# Altium schematic sheet TOP.SchDoc: ANT_Miner_V1.3
size A4; Date: 2013/11/20; DrawnBy: Bitmain technology; SheetNumber: 1; SheetTotal: 9
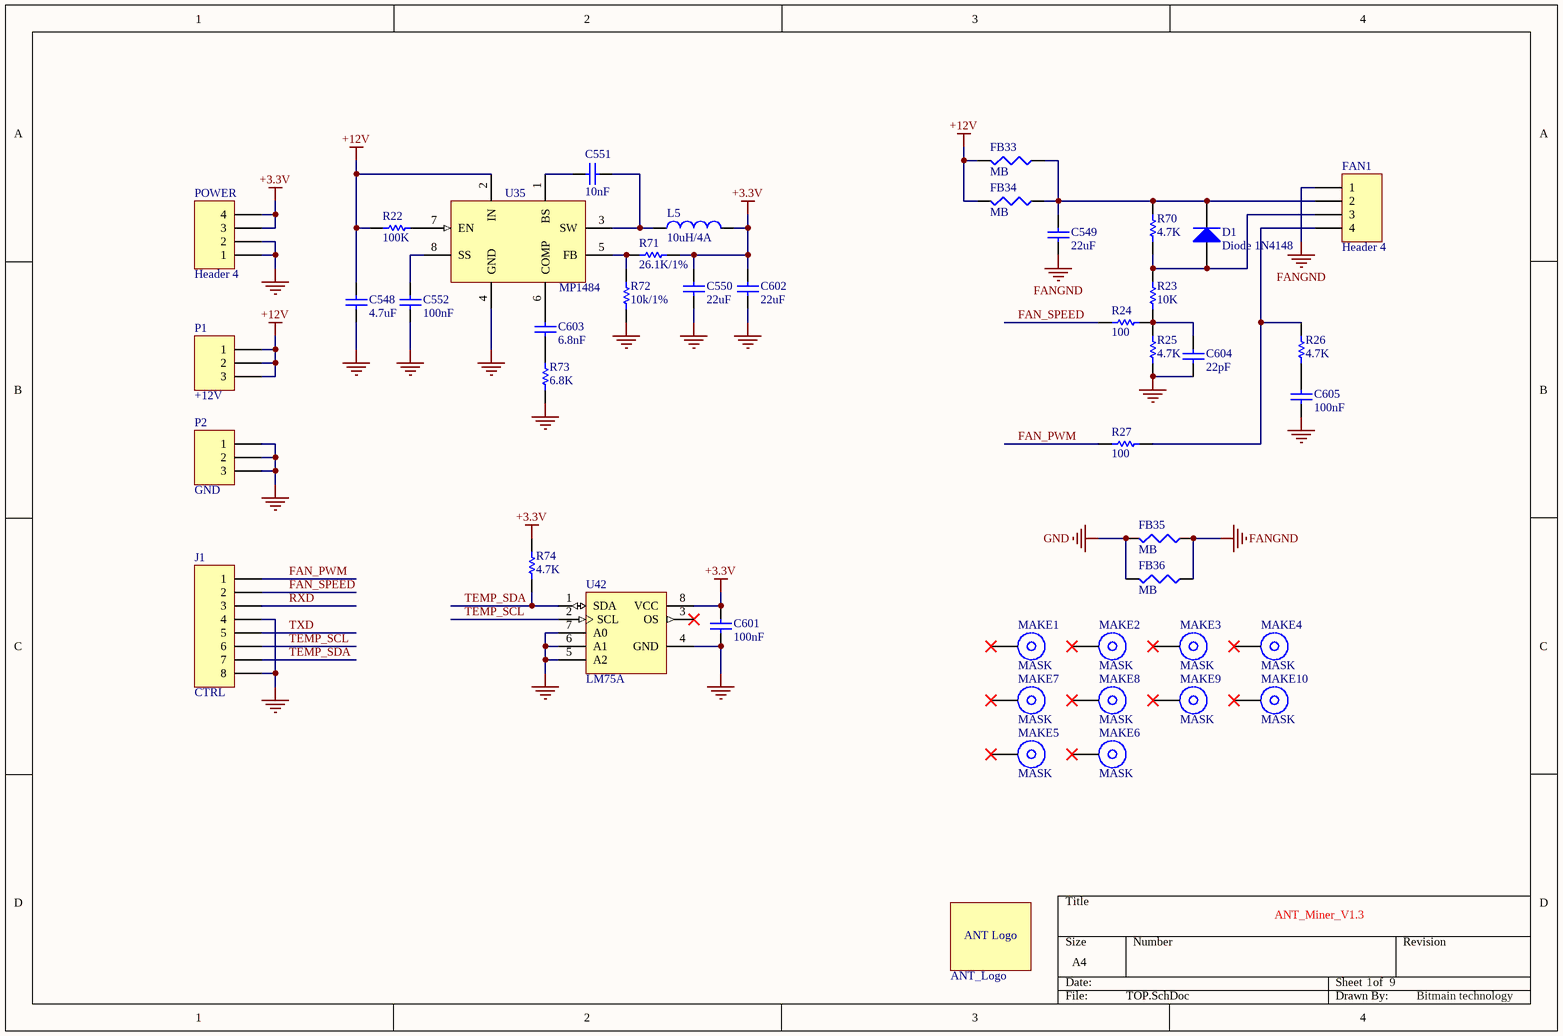
[diagram p0: TOP.SchDoc]

## Parts
?  ANT_Logo  [ANT_Logo_930x370]
C548  4.7uF  [CAP1210(3225)_TAN]
C549  22uF  [CAP1210(3225)_TAN]
C550  22uF  [CAP1210(3225)_TAN]
C551  10nF  [CC0603(1608)]
C552  100nF  [CC0603(1608)]
C601  100nF  [CC0603(1608)]
C602  22uF  [CAP1210(3225)_TAN]
C603  6.8nF  [CC0603(1608)]
C604  22pF  [CC0603(1608)]
C605  100nF  [CC0603(1608)]
D1  Diode 1N4148  [CD3216-1206]
FAN1  Header 4  [4PINFAN]
FB33  MB  [INDC3216L]
FB34  MB  [INDC3216L]
FB35  MB  [INDC3216L]
FB36  MB  [INDC3216L]
J1  CTRL  [8Pin_180]
L5  10uH/4A  [SMD_L_7.4x7.4]
MAKE1  MASK  [MASK]
MAKE2  MASK  [MASK]
MAKE3  MASK  [MASK]
MAKE4  MASK  [MASK]
MAKE5  MASK  [MASK]
MAKE6  MASK  [MASK]
MAKE7  MASK  [MASK]
MAKE8  MASK  [MASK]
MAKE9  MASK  [MASK]
MAKE10  MASK  [MASK]
P1  +12V  [TERMINAL_3]
P2  GND  [TERMINAL_3]
POWER  Header 4  [4Pin_180]
R22  100K  [RR0603(1608)]
R23  10K  [RR0603(1608)]
R24  100  [RR0603(1608)]
R25  4.7K  [RR0603(1608)]
R26  4.7K  [RR0603(1608)]
R27  100  [RR0603(1608)]
R70  4.7K  [RR0603(1608)]
R71  26.1K/1%  [RR0603(1608)]
R72  10k/1%  [RR0603(1608)]
R73  6.8K  [RR0603(1608)]
R74  4.7K  [RR0603(1608)]
U35  MP1484  [SOIC8L]
U42  LM75A  [SO8_L]

## Nets
+3.3V: C550.2 C601.1 C602.2 L5.2 POWER.3 POWER.4 R71.1 R74.2 U42.8(VCC)
+12V: C548.2 FB33.2 FB34.2 P1.1 P1.2 P1.3 R22.2 U35.2(IN)
FANGND: C549.1 FAN1.1 FB35.1 FB36.1
GND: C548.1 C550.1 C552.2 C601.2 C602.1 C604.2 C605.2 FB35.2 FB36.2 J1.4 J1.8 P2.1 P2.2 P2.3 POWER.1 POWER.2 R25.1 R72.1 R73.1 U35.0 U35.4(GND) U42.4(GND) U42.5(A2) U42.6(A1) U42.7(A0)
FAN_PWM: J1.1 R27.2
FAN_SPEED: J1.2 R24.2
RXD: J1.3
TEMP_SCL: J1.6 U42.2(SCL)
TEMP_SDA: J1.7 R74.1 U42.1(SDA)
TXD: J1.5
NetC549_2: C549.2 D1.2(K) FAN1.2 FB33.1 FB34.1 R70.2
NetC551_1: C551.1 U35.1(BS)
NetC551_2: C551.2 L5.1 U35.3(SW)
NetC552_1: C552.1 U35.8(SS)
NetC603_1: C603.1 U35.6(COMP)
NetC603_2: C603.2 R73.2
NetC604_1: C604.1 R23.2 R24.1 R25.2
NetC605_1: C605.1 R26.1
NetD1_1: D1.1(A) FAN1.3 R23.1 R70.1
NetFAN1_4: FAN1.4 R26.2 R27.1
NetR22_1: R22.1 U35.7(EN)
NetR71_2: R71.2 R72.2 U35.5(FB)

Not connected (* = marked no-connect by the designer): MAKE1 1*; MAKE2 1*; MAKE3 1*; MAKE4 1*; MAKE5 1*; MAKE6 1*; MAKE7 1*; MAKE8 1*; MAKE9 1*; MAKE10 1*; U42 3(OS)*

## Notes on the sheet
- (in symbol ANT_Logo) ANT Logo

## Library data of the parts
C548-C552 C601-C605 = Cap Semi: Capacitor (Semiconductor SIM Model); Published: 8-Jun-2000; LatestRevisionDate: 29-May-2009; LatestRevisionNote: IPC-7351 Footprint Added.; PackageReference: C1206; Publisher: Altium Limited; PackageDescription: Chip Capacitor
  C548: Value: 4.7uF
  C549 C550 C602: Value: 22uF
  C551: Value: 10nF
  C552 C601 C605: Value: 100nF
  C603: Value: 6.8nF
  C604: Value: 22pF
D1 = Diode 1N4148: High Conductance Fast Diode; Published: 8-Jun-2000; LatestRevisionDate: 17-Jul-2002; LatestRevisionNote: Re-released for DXP Platform.; DatasheetVersion: 1997; PackageReference: DO-35; Publisher: Altium Limited; PackageDescription: Diode, Axial; Body 3.8 x 1.9 mm (LxDia. max), Lead Dia. 0.53 mm (max); Code_JEDEC: DO-204-AH; ComponentLink1Description: Manufacturer Link; ComponentLink1URL: http://www.fairchildsemi.com/; ComponentLink2Description: Datasheet; ComponentLink2URL: http://www.fairchildsemi.com/ds/1N%2F1N4148.pdf
FAN1 POWER = Header 4: Header, 4-Pin; LatestRevisionDate: 17-Jul-2002; LatestRevisionNote: Re-released for DXP Platform.; Publisher: Altium Limited
FB33-FB36 = Res3: Resistor; Published: 8-Jun-2000; LatestRevisionDate: 29-May-2009; LatestRevisionNote: IPC-7351 Footprint Added.; PackageReference: J1-0603; Publisher: Altium Limited; PackageDescription: Chip Resistor; Value: MB
J1 = Header 8: Header, 8-Pin; LatestRevisionDate: 17-Jul-2002; LatestRevisionNote: Re-released for DXP Platform.; Publisher: Altium Limited
L5 = Inductor: Code_IEC: 1005; Published: 8-Jun-2000; LatestRevisionDate: 29-May-2009; LatestRevisionNote: IPC-7351 Footprint Added.; PackageReference: 0402-A; Publisher: Altium Limited; PackageDescription: Chip Inductor; Code_JEITA: 0402; Value: 10uH/4A
P1 P2 = Header 3: Header, 3-Pin; LatestRevisionDate: 17-Jul-2002; LatestRevisionNote: Re-released for DXP Platform.; Publisher: Altium Limited
R22-R27 R70-R74 = Res1: Resistor; Published: 8-Jun-2000; LatestRevisionDate: 17-Jul-2002; LatestRevisionNote: Re-released for DXP Platform.; PackageReference: AXIAL-0.3; Publisher: Altium Limited; PackageDescription: Axial Device, Thru-Hole; 2 Leads; 0.3 in Pin Spacing
  R22: Value: 100K
  R23: Value: 10K
  R24 R27: Value: 100
  R25 R26 R70 R74: Value: 4.7K
  R71: Value: 26.1K/1%
  R72: Value: 10k/1%
  R73: Value: 6.8K
U42 = LM75A: NXP Digital temperature sensor and thermal watchdog